# Altium schematic sheet 3_CPLD.schdoc
size 307 x 218 mm; Symbol: A4空白; Device: A4空白; @Project Name: 34567890; @Page Count: 7; @Update Date: 2025-05-12; @Create Date: 2025-03-11; @Schematic Name: Schematic1; @Page No: 3; @Page Name: CPLD; @Create Time: 07:05:34; @Board Name: PCB; @Update Time: 12:26:56; Title Block Position: 3; Width: 1170; Height: 825; Region Start: 1; X Region Count: 6; Y Region Count: 4; Blade Width: 10; SheetNumber: 3; SheetTotal: 7
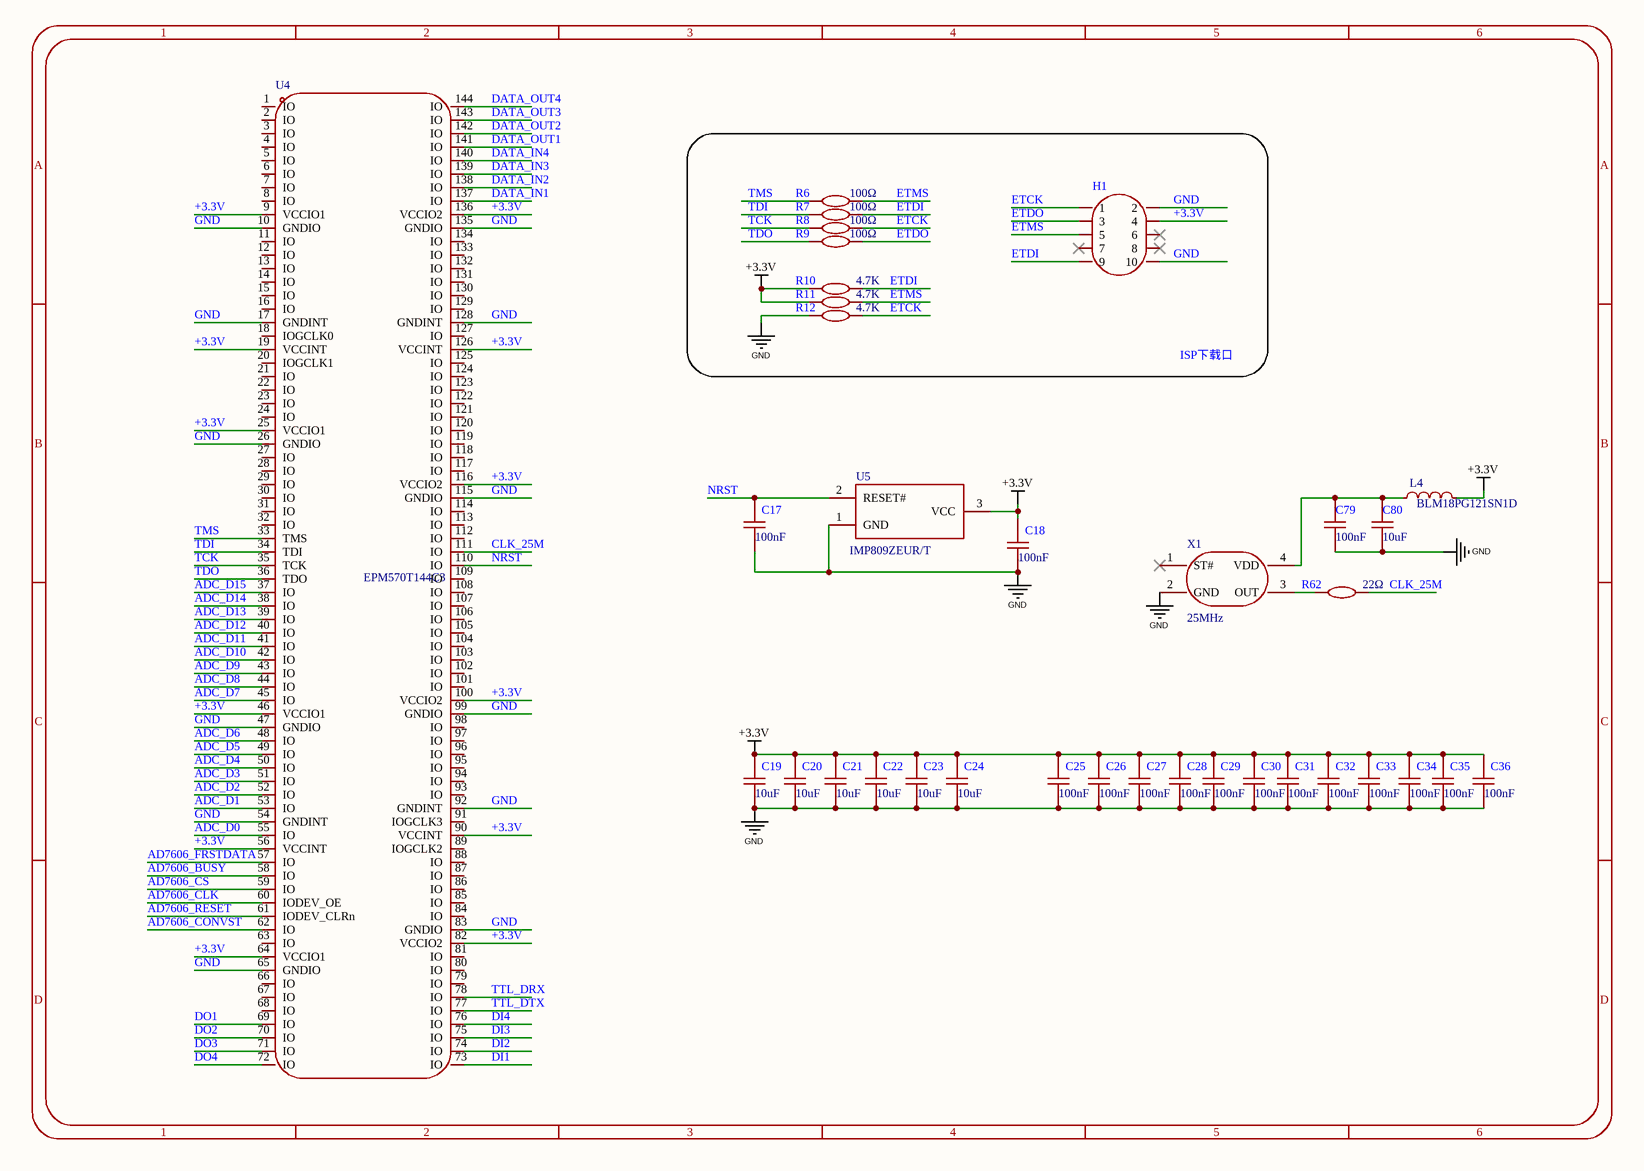
[diagram p0: 3_CPLD.schdoc]

## Parts
C17  100nF  [C0603]
C18  100nF  [C0603]
C19  10uF  [C0805]
C20  10uF  [C0805]
C21  10uF  [C0805]
C22  10uF  [C0805]
C23  10uF  [C0805]
C24  10uF  [C0805]
C25  100nF  [C0603]
C26  100nF  [C0603]
C27  100nF  [C0603]
C28  100nF  [C0603]
C29  100nF  [C0603]
C30  100nF  [C0603]
C31  100nF  [C0603]
C32  100nF  [C0603]
C33  100nF  [C0603]
C34  100nF  [C0603]
C35  100nF  [C0603]
C36  100nF  [C0603]
C79  100nF  [C0603]
C80  10uF  [C0805]
H1  (no value)  [HDR-TH_10P-P2.54-V-F-R2-C5-S2.54]
L4  BLM18PG121SN1D  [L0603]
R6  100Ω  [R0603]
R7  100Ω  [R0603]
R8  100Ω  [R0603]
R9  100Ω  [R0603]
R10  4.7K  [R0603]
R11  4.7K  [R0603]
R12  4.7K  [R0603]
R62  22Ω  [R0603]
U4  EPM570T144C3  [TQFP-144_L20.0-W20.0-P0.50-LS22.0-BL]
U5  IMP809ZEUR/T  [SOT-23-3_L2.9-W1.6-P1.90-LS2.8-BR]
X1  25MHz  [OSC-SMD_4P-L2.5-W2.0-BL]

## Blocks framed on the sheet
ISP下载口: H1 R6-R12

## Nets
+3.3V: C18.2 C19.2 C20.2 C21.2 C22.2 C23.2 C24.2 C25.2 C26.2 C27.2 C28.2 C29.2 C30.2 C31.2 C32.2 C33.2 C34.2 C35.2 C36.2 H1.4 L4.2 R10.1 R11.1 U4.9(VCCIO1) U4.19(VCCINT) U4.25(VCCIO1) U4.46(VCCIO1) U4.56(VCCINT) U4.64(VCCIO1) U4.82(VCCIO2) U4.90(VCCINT) U4.100(VCCIO2) U4.116(VCCIO2) U4.126(VCCINT) U4.136(VCCIO2) U5.3(VCC)
GND: C17.1 C18.1 C19.1 C20.1 C21.1 C22.1 C23.1 C24.1 C25.1 C26.1 C27.1 C28.1 C29.1 C30.1 C31.1 C32.1 C33.1 C34.1 C35.1 C36.1 C79.2 C80.1 H1.2 H1.10 R12.1 U4.10(GNDIO) U4.17(GNDINT) U4.26(GNDIO) U4.47(GNDIO) U4.54(GNDINT) U4.65(GNDIO) U4.83(GNDIO) U4.92(GNDINT) U4.99(GNDIO) U4.115(GNDIO) U4.128(GNDINT) U4.135(GNDIO) U5.1(GND) X1.2(GND)
AD7606_BUSY: U4.58(IO)
AD7606_CLK: U4.60(IODEV_OE)
AD7606_CONVST: U4.62(IO)
AD7606_CS: U4.59(IO)
AD7606_FRSTDATA: U4.57(IO)
AD7606_RESET: U4.61(IODEV_CLRn)
ADC_D0: U4.55(IO)
ADC_D1: U4.53(IO)
ADC_D2: U4.52(IO)
ADC_D3: U4.51(IO)
ADC_D4: U4.50(IO)
ADC_D5: U4.49(IO)
ADC_D6: U4.48(IO)
ADC_D7: U4.45(IO)
ADC_D8: U4.44(IO)
ADC_D9: U4.43(IO)
ADC_D10: U4.42(IO)
ADC_D11: U4.41(IO)
ADC_D12: U4.40(IO)
ADC_D13: U4.39(IO)
ADC_D14: U4.38(IO)
ADC_D15: U4.37(IO)
CLK_25M: R62.2 U4.111(IO)
DATA_IN1: U4.137(IO)
DATA_IN2: U4.138(IO)
DATA_IN3: U4.139(IO)
DATA_IN4: U4.140(IO)
DATA_OUT1: U4.141(IO)
DATA_OUT2: U4.142(IO)
DATA_OUT3: U4.143(IO)
DATA_OUT4: U4.144(IO)
DI1: U4.73(IO)
DI2: U4.74(IO)
DI3: U4.75(IO)
DI4: U4.76(IO)
DO1: U4.69(IO)
DO2: U4.70(IO)
DO3: U4.71(IO)
DO4: U4.72(IO)
ETCK: H1.1 R8.2 R12.2
ETDI: H1.9 R7.2 R10.2
ETDO: H1.3 R9.2
ETMS: H1.5 R6.2 R11.2
NRST: C17.2 U4.110(IO) U5.2(RESET#)
TCK: R8.1 U4.35(TCK)
TDI: R7.1 U4.34(TDI)
TDO: R9.1 U4.36(TDO)
TMS: R6.1 U4.33(TMS)
TTL_DRX: U4.78(IO)
TTL_DTX: U4.77(IO)
NetC79_1: C79.1 C80.2 L4.1 X1.4(VDD)
NetR62_1: R62.1 X1.3(OUT)

Not connected (* = marked no-connect by the designer): H1 6* 7* 8*; U4 1(IO) 2(IO) 3(IO) 4(IO) 5(IO) 6(IO) 7(IO) 8(IO) 11(IO) 12(IO) 13(IO) 14(IO) 15(IO) 16(IO) 18(IOGCLK0) 20(IOGCLK1) 21(IO) 22(IO) 23(IO) 24(IO) 27(IO) 28(IO) 29(IO) 30(IO) 31(IO) 32(IO) 63(IO) 66(IO) 67(IO) 68(IO) 79(IO) 80(IO) 81(IO) 84(IO) 85(IO) 86(IO) 87(IO) 88(IO) 89(IOGCLK2) 91(IOGCLK3) 93(IO) 94(IO) 95(IO) 96(IO) 97(IO) 98(IO) 101(IO) 102(IO) 103(IO) 104(IO) 105(IO) 106(IO) 107(IO) 108(IO) 109(IO) 112(IO) 113(IO) 114(IO) 117(IO) 118(IO) 119(IO) 120(IO) 121(IO) 122(IO) 123(IO) 124(IO) 125(IO) 127(IO) 129(IO) 130(IO) 131(IO) 132(IO) 133(IO) 134(IO); X1 1(ST#)*

## Notes on the sheet
- 1
- 2
- 3
- 4
- 5
- 6
- A
- B
- C
- D

## Library data of the parts
C17 C18 C25-C36 C79 = CAP_0603: Device: CAP_0603
C19-C24 C80 = CAP_0805: Device: CAP_0805
H1 = HDR-F_2.54_2x5: Device: HDR-F_2.54_2x5
R6-R12 R62 = Res_0603: Device: Res_0603
X1 = X1G0041710033: Device: X1G0041710033
L4 = BLM18PG121SN1D: Device: BLM18PG121SN1D
U4 = EPM570T144C3: Device: EPM570T144C3
U5 = IMP809ZEUR/T: Device: IMP809ZEUR/T